# EasyEDA Pro project NI接口485_测试板子_3.eprj, board PCB2
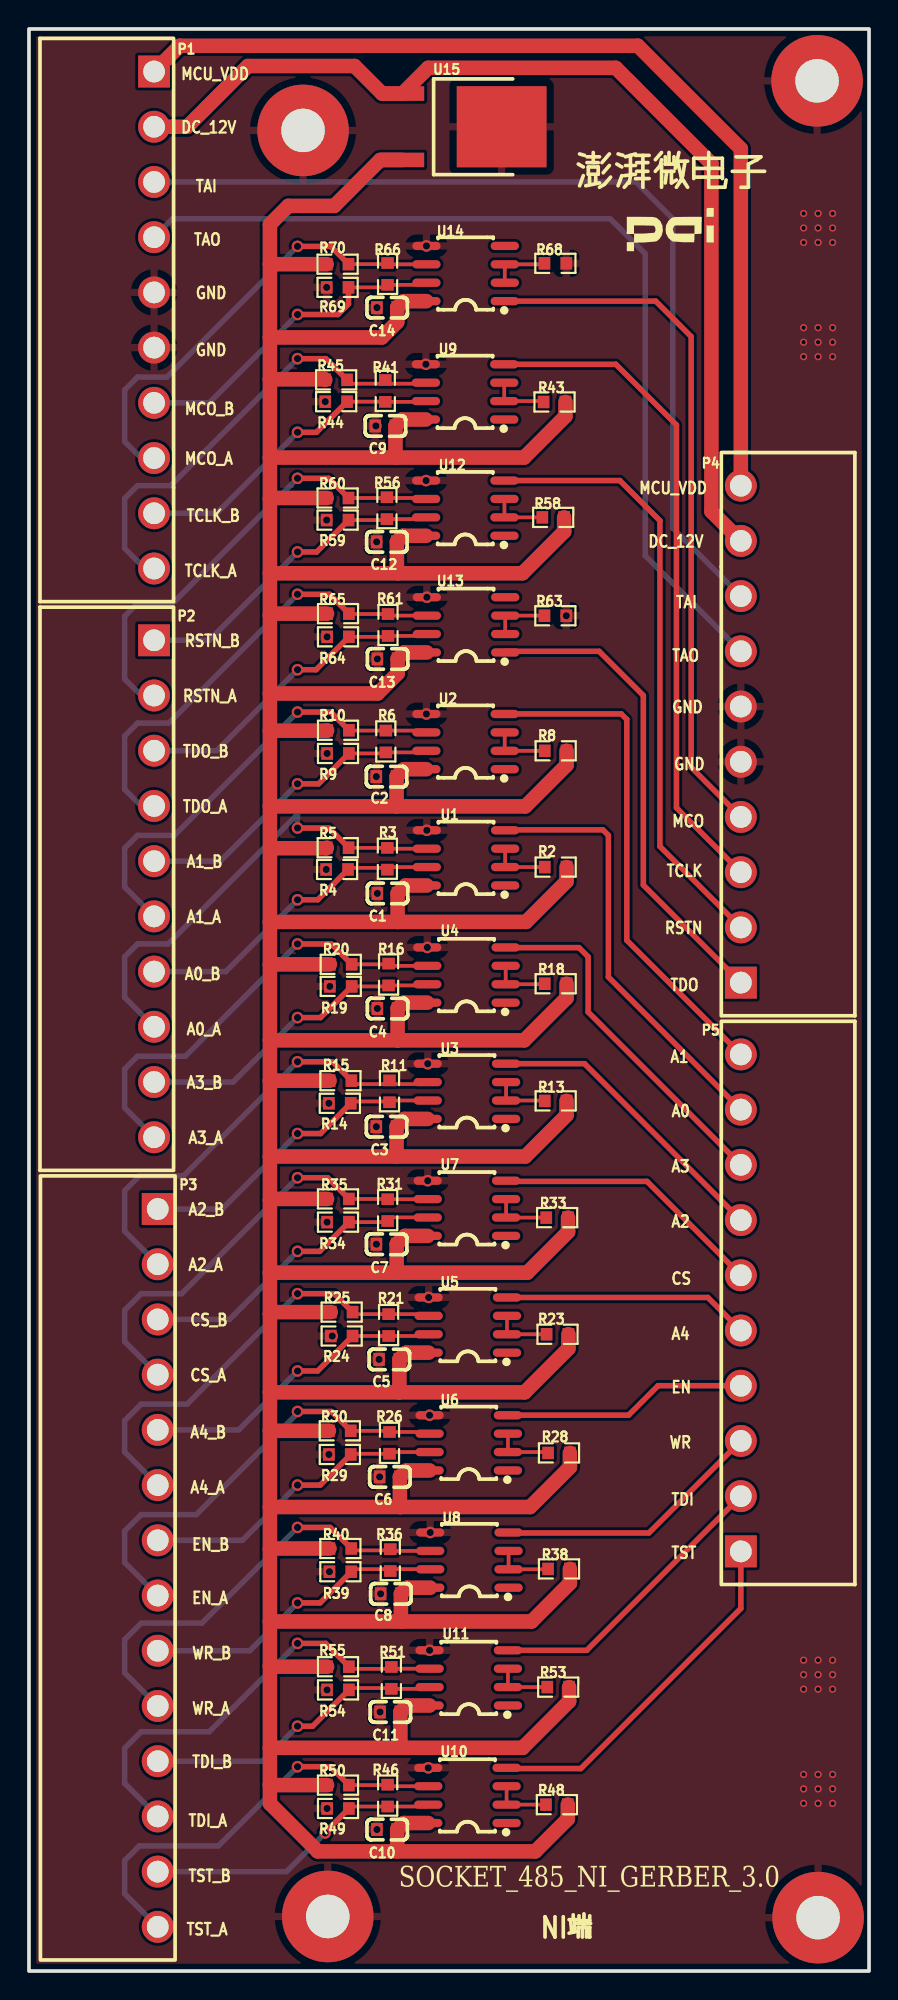
[diagram p4: board, top side]
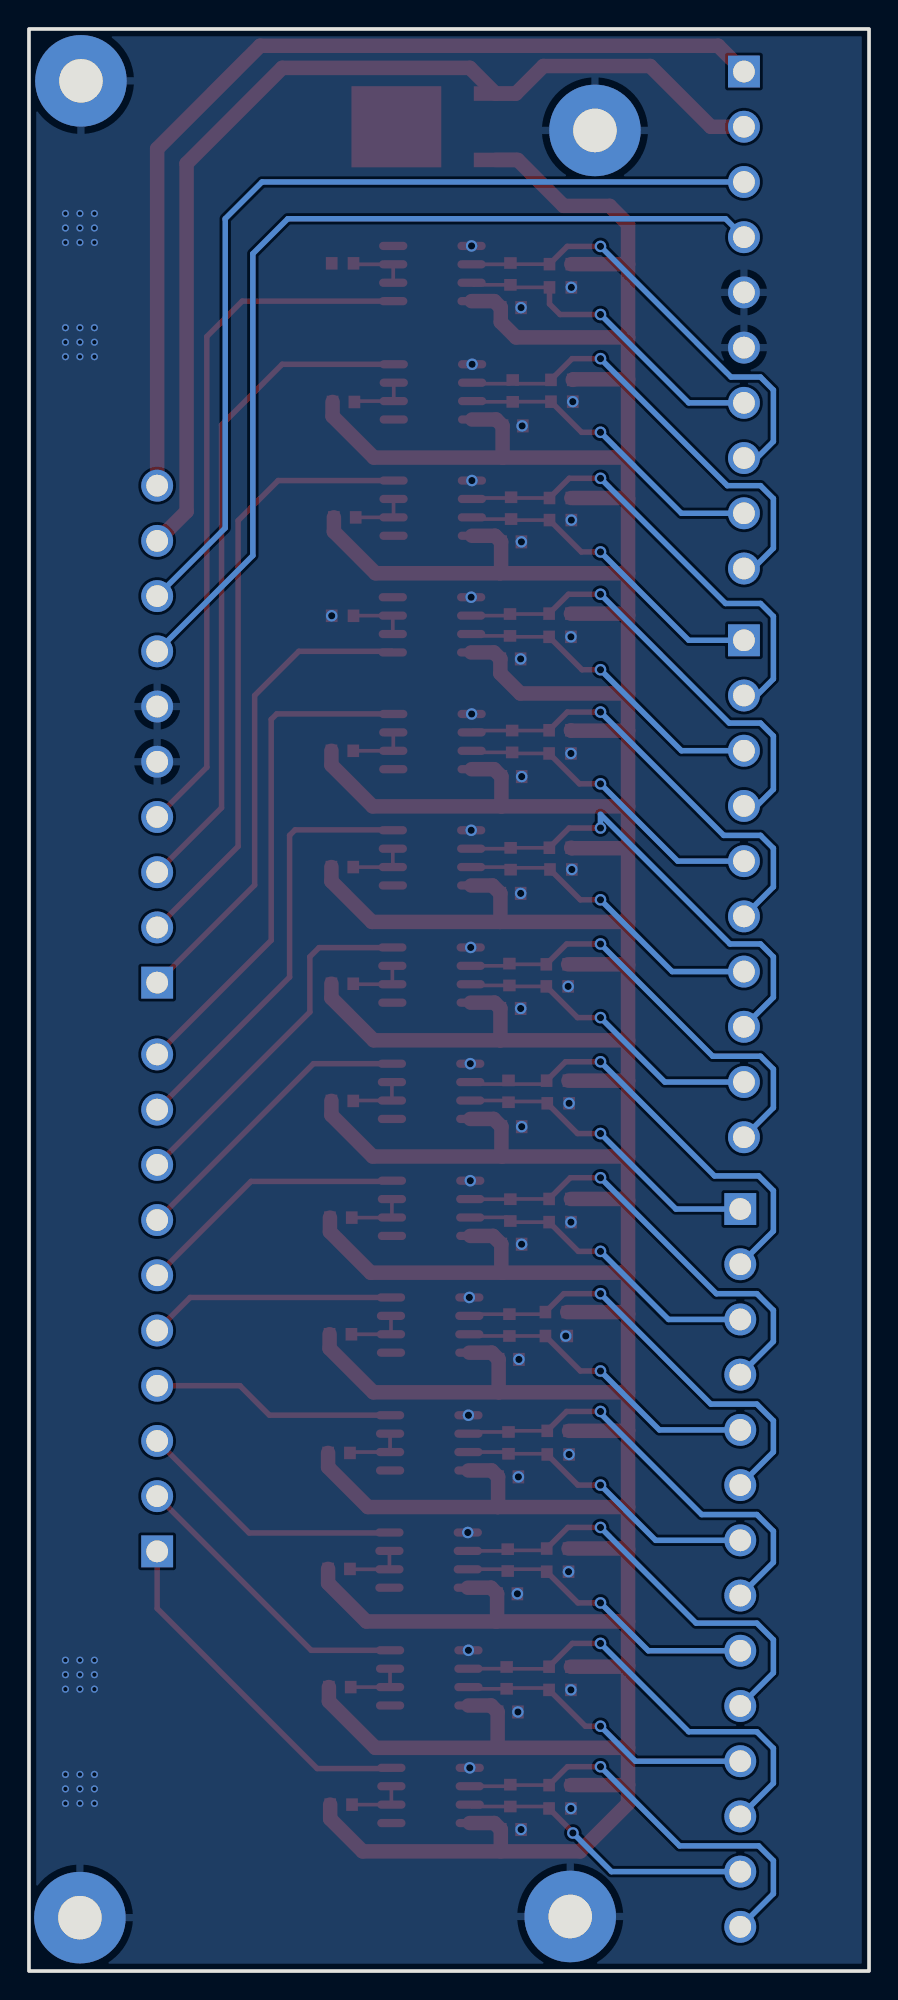
[diagram p5: board, bottom side, seen from below]

Outline 58 x 134 mm; copper layers: Top Layer, Bottom Layer. Coordinates in mm from the lower left corner of the outline.
Outline path: rectangle 0,134 58,0
Stack: Top Layer 0.035mm / Dielectric1 1.51mm FR4 er 4.5 / Bottom Layer 0.035mm

## Design rules (mm)
template: 自定义配置
spacing copperThickness1oz (default): track to track 0.102, other pairs 0.152 to 0.3
spacing copperThickness2oz: track to track 0.203, other pairs 0.152 to 0.3
track width copperThickness1oz (default): min 0.127, default 0.254, max 2.54
track width copperThickness2oz: min 0.203, default 0.254, max 2.54
differential pair differentialPair (default): width min 0.127, default 0.254, max 2.54; gap min 0.152, default 0.152
via viaSize (default): diameter min 0.5, default 0.61, max 10; hole min 0.3, default 0.305, max 6.3

## Placement (name value [footprint] x y rotation side)
C1  10uF  [C0603]  24.75 74.35 180 top
C2  10uF  [C0603]  24.68 82.42 180 top
C3  10uF  [C0603]  24.68 58.26 180 top
C4  10uF  [C0603]  24.75 66.41 180 top
C5  10uF  [C0603]  24.87 42.2 180 top
C6  10uF  [C0603]  24.91 34.1 180 top
C7  10uF  [C0603]  24.69 50.15 180 top
C8  10uF  [C0603]  24.98 26.03 180 top
C9  10uF  [C0603]  24.6 106.61 180 top
C10  10uF  [C0603]  24.72 9.76 180 top
C11  10uF  [C0603]  24.94 17.87 180 top
C12  10uF  [C0603]  24.7 98.61 180 top
C13  10uF  [C0603]  24.75 90.53 180 top
C14  10uF  [C0603]  24.72 114.77 180 top
J1  -  [demo板安装孔]  20.63 3.76 0 top
J2  -  [demo板安装孔]  18.92 127 0 top
J3  -  [demo板安装孔]  54.41 130.42 0 top
J4  -  [demo板安装孔]  54.48 3.68 0 top
P1  WJ15EDGRC-3.81-10P  [CONN-TH_10P-P3.81_WJ15EDGRC-3.81-10P]  8.64 113.92 270 top
P2  WJ15EDGRC-3.81-10P  [CONN-TH_10P-P3.81_WJ15EDGRC-3.81-10P]  8.64 74.68 270 top
P3  WJ15EDGRC-3.81-14P  [CONN-TH_14P-P3.81_WJ15EDGRC-3.81-14P]  8.89 27.81 270 top
P4  WJ15EDGRC-3.81-10P  [CONN-TH_10P-P3.81_WJ15EDGRC-3.81-10P]  49.15 85.34 90 top
P5  WJ15EDGRC-3.81-10P  [CONN-TH_10P-P3.81_WJ15EDGRC-3.81-10P]  49.15 46.1 90 top
R2  4.7kΩ  [R0603]  36.37 76.17 0 top
R3  120Ω  [R0603]  24.75 76.75 270 top
R4  4.7kΩ  [R0603]  21.27 76.01 180 top
R5  4.7kΩ  [R0603]  21.32 77.51 0 top
R6  120Ω  [R0603]  24.64 84.84 270 top
R8  4.7kΩ  [R0603]  36.37 84.19 0 top
R9  4.7kΩ  [R0603]  21.34 84.01 180 top
R10  4.7kΩ  [R0603]  21.34 85.61 0 top
R11  120Ω  [R0603]  24.89 60.7 270 top
R13  4.7kΩ  [R0603]  36.37 60.04 0 top
R14  4.7kΩ  [R0603]  21.46 59.87 180 top
R15  4.7kΩ  [R0603]  21.51 61.43 0 top
R16  120Ω  [R0603]  24.83 68.76 270 top
R18  4.7kΩ  [R0603]  36.37 68.12 0 top
R19  4.7kΩ  [R0603]  21.53 67.94 180 top
R20  4.7kΩ  [R0603]  21.53 69.46 0 top
R21  120Ω  [R0603]  24.83 44.57 270 top
R23  4.7kΩ  [R0603]  36.49 43.94 0 top
R24  4.7kΩ  [R0603]  21.59 43.81 180 top
R25  4.7kΩ  [R0603]  21.59 45.47 0 top
R26  120Ω  [R0603]  24.89 36.44 270 top
R28  4.7kΩ  [R0603]  36.59 35.75 0 top
R29  4.7kΩ  [R0603]  21.46 35.64 180 top
R30  4.7kΩ  [R0603]  21.46 37.27 0 top
R31  120Ω  [R0603]  24.77 52.5 270 top
R33  4.7kΩ  [R0603]  36.47 51.98 0 top
R34  4.7kΩ  [R0603]  21.34 51.67 180 top
R35  4.7kΩ  [R0603]  21.34 53.27 0 top
R36  120Ω  [R0603]  24.95 28.35 270 top
R38  4.7kΩ  [R0603]  36.59 27.75 0 top
R39  4.7kΩ  [R0603]  21.5 27.55 180 top
R40  4.7kΩ  [R0603]  21.5 29.15 0 top
R41  120Ω  [R0603]  24.6 109.03 270 top
R43  4.7kΩ  [R0603]  36.29 108.26 0 top
R44  4.7kΩ  [R0603]  21.21 108.29 180 top
R45  4.7kΩ  [R0603]  21.21 109.79 0 top
R46  120Ω  [R0603]  24.77 12.1 270 top
R48  4.7kΩ  [R0603]  36.45 11.48 0 top
R49  4.7kΩ  [R0603]  21.34 11.22 180 top
R50  4.7kΩ  [R0603]  21.34 12.83 0 top
R51  120Ω  [R0603]  25.02 20.22 270 top
R53  4.7kΩ  [R0603]  36.54 19.59 0 top
R54  4.7kΩ  [R0603]  21.34 19.4 180 top
R55  4.7kΩ  [R0603]  21.34 21 0 top
R56  120Ω  [R0603]  24.71 100.94 270 top
R58  4.7kΩ  [R0603]  36.19 100.3 0 top
R59  4.7kΩ  [R0603]  21.31 100.11 180 top
R60  4.7kΩ  [R0603]  21.31 101.64 0 top
R61  120Ω  [R0603]  24.79 92.88 270 top
R63  4.7kΩ  [R0603]  36.34 93.51 0 top
R64  4.7kΩ  [R0603]  21.34 92.06 180 top
R65  4.7kΩ  [R0603]  21.34 93.66 0 top
R66  120Ω  [R0603]  24.76 117.1 270 top
R68  4.7kΩ  [R0603]  36.34 117.83 0 top
R69  4.7kΩ  [R0603]  21.31 116.17 180 top
R70  4.7kΩ  [R0603]  21.31 117.77 0 top
U1  SP485EEN-L/TR  [SOIC-8_L5.0-W4.0-P1.27-LS6.0-BL]  30.17 76.81 90 top
U2  SP485EEN-L/TR  [SOIC-8_L5.0-W4.0-P1.27-LS6.0-BL]  30.14 84.83 90 top
U3  SP485EEN-L/TR  [SOIC-8_L5.0-W4.0-P1.27-LS6.0-BL]  30.24 60.7 90 top
U4  SP485EEN-L/TR  [SOIC-8_L5.0-W4.0-P1.27-LS6.0-BL]  30.21 68.72 90 top
U5  SP485EEN-L/TR  [SOIC-8_L5.0-W4.0-P1.27-LS6.0-BL]  30.3 44.57 90 top
U6  SP485EEN-L/TR  [SOIC-8_L5.0-W4.0-P1.27-LS6.0-BL]  30.36 36.44 90 top
U7  SP485EEN-L/TR  [SOIC-8_L5.0-W4.0-P1.27-LS6.0-BL]  30.24 52.63 90 top
U8  SP485EEN-L/TR  [SOIC-8_L5.0-W4.0-P1.27-LS6.0-BL]  30.41 28.35 90 top
U9  SP485EEN-L/TR  [SOIC-8_L5.0-W4.0-P1.27-LS6.0-BL]  30.11 108.96 90 top
U10  SP485EEN-L/TR  [SOIC-8_L5.0-W4.0-P1.27-LS6.0-BL]  30.27 12.11 90 top
U11  SP485EEN-L/TR  [SOIC-8_L5.0-W4.0-P1.27-LS6.0-BL]  30.36 20.22 90 top
U12  SP485EEN-L/TR  [SOIC-8_L5.0-W4.0-P1.27-LS6.0-BL]  30.12 100.94 90 top
U13  SP485EEN-L/TR  [SOIC-8_L5.0-W4.0-P1.27-LS6.0-BL]  30.18 92.89 90 top
U14  SP485EEN-L/TR  [SOIC-8_L5.0-W4.0-P1.27-LS6.0-BL]  30.15 117.13 90 top
U15  78M05  [TO-252-2_L6.5-W5.5-P4.58-LS9.8-BR-CW]  29.21 127.25 180 top

## Footprints (pads in the part's own frame, mm; a bottom-side part is the same pattern mirrored in y, then rotated)
C0603
  rect 0.8x0.9 smd: 1(-0.7,0) 2(0.7,0)
CONN-TH_10P-P3.81_WJ15EDGRC-3.81-10P
  rect 2.2x2.2 hole 1.5: 1(-17.145,0)
  round 2.2 hole 1.5: 2(-13.335,0) 3(-9.525,0) 4(-5.715,0) 5(-1.905,0) 6(1.905,0) 7(5.715,0) 8(9.525,0) 9(13.335,0) 10(17.145,0)
CONN-TH_14P-P3.81_WJ15EDGRC-3.81-14P
  rect 2.2x2.2 hole 1.5: 1(-24.765,0)
  round 2.2 hole 1.5: 2(-20.955,0) 3(-17.145,0) 4(-13.335,0) 5(-9.525,0) 6(-5.715,0) 7(-1.905,0) 8(1.905,0) 9(5.715,0) 10(9.525,0) 11(13.335,0) 12(17.145,0) 13(20.955,0) 14(24.765,0)
demo板安装孔
  round 6.32 hole 3: 1(0,0)
R0603
  rect 0.806x0.864 smd: 1(-0.753,0) 2(0.753,0)
SOIC-8_L5.0-W4.0-P1.27-LS6.0-BL
  oval 0.569x1.95 smd: 1(-1.905,-2.705) 2(-0.635,-2.705) 3(0.635,-2.705) 4(1.905,-2.705) 5(1.905,2.705) 6(0.635,2.705) 7(-0.635,2.705) 8(-1.905,2.705)
TO-252-2_L6.5-W5.5-P4.58-LS9.8-BR-CW
  rect 3x1 smd: 1(3.423,-2.29) 3(3.424,2.29)
  rect 6.2x5.6 smd: 2(-3.424,0)

## Nets
As in the schematic.

Pads without a net: U1 1; U2 1; U3 1; U4 1; U5 1; U6 1; U7 1; U8 1; U9 1; U10 1; U11 1; U12 1; U13 4; U14 4

## Via types
v1: diameter 0.8, hole 0.5, Top Layer to Bottom Layer, 71 vias
v2: diameter 0.5, hole 0.305, Top Layer to Bottom Layer, 36 vias

## Routing (per net, layer and track width the routed paths; a pad name or vN(x,y) marks a point on that pad's centre or on a via; arc(x,y) is an arc through that point)
GND:
  vias: v1(20.46,108.29) v1(20.55,116.17) v1(20.55,100.11) v1(20.52,76.01) v1(20.58,92.06) v1(20.58,84.01) v1(20.58,51.67) v1(20.58,19.4) v1(20.58,11.22) v1(20.71,59.87) v1(20.71,35.64) v1(20.75,27.55) v1(20.77,67.94) v1(20.94,43.81) v1(23.95,106.61) v1(24.03,114.77) v1(24,98.61) v1(24.05,90.53) v1(23.98,82.42) v1(24.05,74.35) v1(24.05,66.41) v1(23.98,58.26) v1(23.99,50.15) v1(24.02,9.76) v1(24.17,42.2) v1(24.21,34.1) v1(24.24,17.87) v1(24.28,26.03) v1(27.44,119.03) v1(27.4,110.86) v1(27.42,102.84) v1(27.44,86.73) v1(27.47,94.79) v1(27.47,78.71) v1(27.5,70.63) v1(27.53,62.6) v1(27.53,54.53) v1(27.59,46.48) v1(27.66,38.35) v1(27.66,22.13) v1(27.57,14.02) v1(27.7,30.26) v1(37.1,93.51) v2(53.48,121.27) v2(53.48,120.27) v2(53.48,119.27) v2(53.48,113.39) v2(53.48,112.39) v2(53.48,111.39) v2(53.48,21.45) v2(53.48,20.45) v2(53.48,19.45) v2(53.48,13.57) v2(53.48,12.57) v2(53.48,11.57) v2(54.48,121.27) v2(54.48,120.27) v2(54.48,119.27) v2(54.48,113.39) v2(54.48,112.39) v2(54.48,111.39) v2(54.48,21.45) v2(54.48,20.45) v2(54.48,19.45) v2(54.48,13.57) v2(54.48,12.57) v2(54.48,11.57) v2(55.48,121.27) v2(55.48,120.27) v2(55.48,119.27) v2(55.48,113.39) v2(55.48,112.39) v2(55.48,111.39) v2(55.48,21.45) v2(55.48,20.45) v2(55.48,19.45) v2(55.48,13.57) v2(55.48,12.57) v2(55.48,11.57)
DC_12V: length 71.4
  Top Layer w1: P1.2 10.92,127.25 15.11,131.44 22.48,131.44 24.38,129.54 U15.1 27.56,131.32 40.51,131.32 47.12,124.71 47.12,100.71 P4.9
LDO_5V: length 527
  Top Layer w0.254: 20.57,117.73 20.55,117.75 R70.1
  Top Layer w1: U2.8 25.89,82.92 C2.1 25.38,80.37 25.38,80.36 ; 25.31,48.19 16.64,48.19 ; 25.31,48.19 25.39,48.27 C7.1 25.96,50.72 U7.8 ; 25.31,48.19 34.41,48.19 37.22,51 R33.2 ; 16.64,48.19 16.64,53.18 ; 16.64,48.19 16.64,45.34 ; 25.55,39.93 25.57,39.95 C5.1 26.04,42.67 U5.8 ; 25.55,39.93 16.64,39.93 ; 25.55,39.93 34.22,39.93 37.25,42.95 R23.2 ; 16.64,45.34 16.77,45.47 R25.1 ; 16.64,45.34 16.64,39.93 ; 16.64,24.12 16.64,21.06 ; 16.64,24.12 16.64,29.1 ; 16.64,24.12 25.74,24.12 ; 16.64,21.06 16.64,15.4 ; 16.64,21.06 16.71,21 R55.1 ; 25.3,104.43 25.3,104.43 C9.1 25.74,107.05 U9.8 ; 25.3,104.43 16.64,104.43 ; 25.3,104.43 34.19,104.43 37.04,107.28 R43.2 ; U6.8 26.05,34.54 C6.1 25.61,32.04 25.64,32.02 ; 16.64,61.42 16.65,61.43 R15.1 ; 16.64,61.42 16.64,56.2 ; 16.64,61.42 16.64,64.22 ; U8.8 26.1,26.45 C8.1 25.68,24.18 25.74,24.12 ; 16.64,39.93 16.64,37.3 ; 16.64,80.36 25.38,80.36 ; 16.64,80.36 16.64,85.58 ; 16.64,80.36 16.64,77.47 ; 25.38,80.36 34.27,80.36 37.12,83.21 R8.2 ; U14.8 25.87,115.22 C14.1 25.43,113.77 24.37,112.72 16.64,112.72 ; 16.64,15.4 25.64,15.4 ; 16.64,15.4 16.64,12.84 ; 25.64,15.4 C11.1 26.09,18.32 U11.8 ; 25.64,15.4 34.09,15.4 37.29,18.61 R53.2 ; 16.64,112.72 16.64,109.83 ; 16.64,112.72 16.64,117.77 ; 16.64,109.83 20.42,109.83 R45.1 ; 16.64,109.83 16.64,104.43 ; 16.64,29.1 16.64,32.02 ; 16.64,29.1 16.69,29.15 R40.1 ; 16.64,56.2 25.33,56.2 ; 16.64,56.2 16.64,53.18 ; 25.33,56.2 25.38,56.25 C3.1 25.92,58.79 U3.8 ; 25.33,56.2 34.27,56.2 37.12,59.05 R13.2 ; 16.64,77.47 20.53,77.47 R5.1 ; 16.64,77.47 16.64,72.39 ; 16.64,37.3 16.67,37.27 R30.1 ; 16.64,37.3 16.64,32.02 ; R35.1 16.73,53.27 16.64,53.18 ; R18.2 37.12,67.14 34.2,64.22 25.46,64.22 ; 16.64,12.84 16.64,11.56 19.94,8.25 34.96,8.25 37.2,10.5 R48.2 ; 16.64,12.84 16.65,12.83 R50.1 ; 25.46,64.22 16.64,64.22 ; 25.46,64.22 25.45,64.22 C4.1 25.85,66.82 U4.8 ; R2.2 37.12,75.19 34.32,72.39 25.49,72.39 ; U1.8 26,74.9 C1.1 25.45,72.42 25.49,72.39 ; U13.8 25.9,90.98 C13.1 25.45,89.53 24.07,88.15 16.64,88.15 ; 16.64,72.39 25.49,72.39 ; 16.64,72.39 16.64,69.42 ; 16.64,32.02 25.64,32.02 ; 16.64,93.55 16.64,88.15 ; 16.64,93.55 16.74,93.66 R65.1 ; 16.64,93.55 16.64,96.45 ; 16.64,88.15 16.64,85.58 ; 16.64,104.43 16.64,101.59 ; R20.1 16.68,69.46 16.64,69.42 ; R60.1 16.69,101.64 16.64,101.59 ; 16.64,85.58 20.55,85.58 R10.1 ; 16.64,69.42 16.64,64.22 ; 16.64,101.59 16.64,96.45 ; 16.64,96.45 25.47,96.45 ; 25.64,32.02 34.6,32.02 37.35,34.76 R28.2 ; 16.64,117.77 16.64,120.52 17.91,121.79 21.08,121.79 24.25,124.96 U15.3 ; 16.64,117.77 R70.1 ; R58.2 36.95,99.32 34.07,96.45 25.47,96.45 ; 25.74,24.12 34.7,24.12 37.35,26.76 R38.2 ; 25.47,96.45 25.4,96.52 C12.1 25.82,99.03 U12.8 ; 25.42,8.26 C10.1 25.87,10.21 U10.8
MCO_NI: length 48.4
  Top Layer w0.38: U14.1 43.28,115.22 45.72,112.78 45.72,83.06 P4.4
MCO_NI_A: length 31.6
  Top Layer w0.254: R70.2 24.68,117.77 R66.1 24.85,117.76 U14.6
  Top Layer w0.38: v1(18.54,119) 20.83,119 R70.2
  Bottom Layer w0.38: P1.8 7.75,104.39 6.6,105.54 6.6,109.09 7.49,109.98 9.53,109.98 v1(18.54,119)
MCO_NI_B: length 22.9
  Top Layer w0.254: R69.1 24.59,116.17 R66.2 27.3,116.35 U14.7
  Top Layer w0.38: R69.1 22.06,115.02 21.34,114.3 v1(18.54,114.3)
  Bottom Layer w0.38: P1.7 12.45,108.2 v1(18.54,114.3)
MCU_VDD: length 67.4
  Top Layer w1: P4.10 49.15,125.73 42.04,132.84 10.41,132.84 P1.1
RSTN_NI: length 42.3
  Top Layer w0.38: P4.2 43.56,77.6 43.56,100.08 40.8,102.84 U12.4
RSTN_NI_A: length 32.2
  Top Layer w0.254: 24.66,101.64 R60.2 ; 24.66,101.64 R56.1 ; 24.66,101.64 27.35,101.64 U12.6
  Top Layer w0.38: v1(18.54,103) 20.7,103 R60.2
  Bottom Layer w0.38: v1(18.54,103) 9.91,94.36 7.49,94.36 6.6,93.47 6.6,89.15 7.75,88.01 P2.2
RSTN_NI_B: length 22.3
  Top Layer w0.254: U12.7 27.3,100.18 R56.2 24.64,100.11 R59.1
  Top Layer w0.38: R59.1 19.86,97.92 v1(18.54,97.92)
  Bottom Layer w0.38: v1(18.54,97.92) 12.45,91.82 P2.1
SW_A0: length 30
  Top Layer w0.38: U1.4 32.91,78.74 39.62,78.74 40,78.36 40,68.58 P5.9
SW_A0_A: length 32.1
  Top Layer w0.254: 22.08,77.5 R3.1 24.8,77.44 U1.6
  Top Layer w0.38: R5.2 20.71,78.87 v1(18.54,78.87)
  Bottom Layer w0.38: 8.64,65.15 6.6,67.18 6.6,69.98 7.49,70.87 9.6,70.87 18.54,79.81 v1(18.54,78.87)
SW_A0_B: length 21.9
  Top Layer w0.254: U1.7 24.92,76.17 R3.2 24.62,76.12 22.14,76.12 22.03,76.01
  Top Layer w0.38: 22.03,76.01 19.94,73.91 v1(18.54,73.91)
  Bottom Layer w0.38: P2.7 13.59,68.96 v1(18.54,73.91)
SW_A1: length 35
  Top Layer w0.38: U2.4 32.85,86.74 40.9,86.74 41.28,86.36 41.28,71.12 P5.10
SW_A1_A: length 30.8
  Top Layer w0.254: U2.6 27.31,85.59 R6.1 22.11,85.59
  Top Layer w0.38: R10.2 20.83,86.87 v1(18.54,86.87)
  Bottom Layer w0.38: v1(18.54,86.87) 10.03,78.36 7.49,78.36 6.6,77.47 6.6,74.8 P2.6
SW_A1_B: length 22
  Top Layer w0.254: U2.7 27.33,84.09 R6.2 24.56,84.01 R9.1
  Top Layer w0.38: v1(18.54,81.91) 19.99,81.91 R9.1
  Bottom Layer w0.38: P2.5 13.21,76.58 v1(18.54,81.91)
SW_A2: length 20.7
  Top Layer w0.38: P5.7 38.36,62.6 U3.4
SW_A2_A: length 31.5
  Top Layer w0.254: R15.2 22.5,61.2 24.64,61.2 R11.1 25.15,61.2 27.4,61.2 U3.6
  Top Layer w0.38: R15.2 20.96,62.74 v1(18.54,62.74)
  Bottom Layer w0.38: v1(18.54,62.74) 10.67,54.86 7.62,54.86 6.6,53.85 6.6,51.05 P3.2
SW_A2_B: length 21.8
  Top Layer w0.254: R14.1 22.34,60 24.84,60 R11.2 25.01,60.06 U3.7
  Top Layer w0.38: R14.1 20.13,57.78 v1(18.54,57.78)
  Bottom Layer w0.38: v1(18.54,57.78) 13.34,52.58 P3.1
SW_A3: length 24.7
  Top Layer w0.38: P5.8 38.61,66.17 38.61,69.98 37.97,70.61 32.93,70.61 U4.4
SW_A3_A: length 30.7
  Top Layer w0.254: U4.6 24.98,69.36 24.83,69.51 24.78,69.46 R20.2
  Top Layer w0.38: R20.2 20.88,70.87 v1(18.54,70.87)
  Bottom Layer w0.38: v1(18.54,70.87) 10.8,63.12 7.49,63.12 6.6,62.23 6.6,59.56 P2.10
SW_A3_B: length 21.7
  Top Layer w0.254: R19.1 24.76,67.94 R16.2 27.42,68 U4.7
  Top Layer w0.38: R19.1 20.13,65.79 v1(18.54,65.79)
  Bottom Layer w0.38: P2.9 14.1,61.34 v1(18.54,65.79)
SW_A4: length 17.1
  Top Layer w0.38: P5.5 46.87,46.48 33,46.48
SW_A4_A: length 30.6
  Top Layer w0.254: R25.2 22.49,45.32 R21.1 27.48,45.32 U5.6
  Top Layer w0.38: v1(18.54,46.74) 21.07,46.74 R25.2
  Bottom Layer w0.38: v1(18.54,46.74) 10.92,39.12 7.75,39.12 6.6,37.97 6.6,35.81 P3.6
SW_A4_B: length 21.4
  Top Layer w0.254: 22.35,43.82 R21.2 27.48,43.82 U5.7
  Top Layer w0.38: R24.1 19.93,41.4 v1(18.54,41.4)
  Bottom Layer w0.38: v1(18.54,41.4) 14.48,37.34 P3.5
SW_CS_N: length 18.9
  Top Layer w0.38: U7.4 32.99,54.48 42.67,54.48 P5.6
SW_CS_N_A: length 30.7
  Top Layer w0.254: R35.2 24.75,53.27 R31.1 27.52,53.25 U7.6
  Top Layer w0.38: v1(18.54,54.74) 20.62,54.74 R35.2
  Bottom Layer w0.38: v1(18.54,54.74) 10.54,46.74 7.75,46.74 6.6,45.59 6.6,43.43 P3.4
SW_CS_N_B: length 21.6
  Top Layer w0.254: U7.7 27.52,52 25.02,52 R31.2 24.69,51.67 R34.1
  Top Layer w0.38: v1(18.54,49.66) 20.07,49.66 R34.1
  Bottom Layer w0.38: P3.3 13.84,44.96 v1(18.54,49.66)
SW_EN_N: length 16.9
  Top Layer w0.38: U6.4 33.07,38.35 41.4,38.35 43.43,40.39 P5.4
SW_EN_N_A: length 30.6
  Top Layer w0.254: R30.2 24.81,37.27 R26.1 27.54,37.2 U6.6
  Top Layer w0.38: R30.2 20.88,38.61 v1(18.54,38.61)
  Bottom Layer w0.38: v1(18.54,38.61) 18.54,38.48 11.56,31.5 7.75,31.5 6.6,30.35 6.6,28.19 P3.8
SW_EN_N_B: length 21.3
  Top Layer w0.254: R29.1 22.26,35.69 R26.2 25.01,35.81 U6.7
  Top Layer w0.38: R29.1 20.1,33.53 v1(18.54,33.53)
  Bottom Layer w0.38: v1(18.54,33.53) 14.73,29.72 P3.7
SW_WR_N: length 18.7
  Top Layer w0.38: U8.4 33.15,30.23 42.8,30.23 P5.3
SW_WR_N_A: length 30.6
  Top Layer w0.254: R40.2 22.38,29.03 24.87,29.03 R36.1 25.06,28.99 U8.6
  Top Layer w0.38: v1(18.54,30.61) 20.8,30.61 R40.2
  Bottom Layer w0.38: P3.10 6.6,20.57 6.6,22.86 7.75,24 11.94,24 v1(18.54,30.61)
SW_WR_N_B: length 21.3
  Top Layer w0.254: U8.7 27.69,27.73 25.07,27.73 R36.2 24.82,27.73 22.43,27.73 R39.1
  Top Layer w0.38: v1(18.54,25.4) 20.1,25.4 R39.1
  Bottom Layer w0.38: v1(18.54,25.4) 15.24,22.1 P3.9
TAI_NI: length 64.8
  Bottom Layer w0.38: P4.8 44.45,99.57 44.45,120.9 41.91,123.44 P1.3
TAO_NI: length 65.6
  Bottom Layer w0.38: P4.7 42.55,97.66 42.55,118.49 40.13,120.9 9.91,120.9 P1.4
TCLK_NI: length 46.3
  Top Layer w0.38: U9.4 40.52,110.86 44.7,106.68 44.7,80.26 P4.3
TCLK_NI_A: length 31.8
  Top Layer w0.254: R45.2 22.23,109.52 24.35,109.52 R41.1 24.86,109.52 27.33,109.52 U9.6
  Top Layer w0.38: R45.2 20.5,111.25 v1(18.54,111.25)
  Bottom Layer w0.38: v1(18.54,111.25) 9.78,102.49 7.49,102.49 6.6,101.6 6.6,98.17 8,96.77 P1.10
TCLK_NI_B: length 22
  Top Layer w0.254: R44.1 24.59,108.29 R41.2 27.35,108.27 U9.7
  Top Layer w0.38: v1(18.54,106.17) 19.85,106.17 R44.1
  Bottom Layer w0.38: v1(18.54,106.17) 12.95,100.58 P1.9
TDI_NI: length 20.5
  Top Layer w0.38: U11.4 38.51,22.13 P5.2
TDI_NI_A: length 30.5
  Top Layer w0.254: R55.2 22.24,20.85 24.89,20.85 R51.1 25.14,20.86 U11.6
  Top Layer w0.38: R55.2 20.48,22.61 v1(18.54,22.61)
  Bottom Layer w0.38: v1(18.54,22.61) 12.45,16.51 7.75,16.51 6.6,15.37 6.6,12.95 P3.12
TDI_NI_B: length 20.9
  Top Layer w0.254: U11.7 27.54,19.47 R51.2 24.97,19.52 22.22,19.52 R54.1
  Top Layer w0.38: v1(18.54,16.89) 19.58,16.89 R54.1
  Bottom Layer w0.38: P3.11 16.13,14.48 v1(18.54,16.89)
TDO_NI: length 33.4
  Top Layer w0.38: U13.1 32.96,91.06 39.37,91.06 42.42,88.01 42.42,74.93 P4.1
TDO_NI_A: length 31.7
  Top Layer w0.254: U13.6 24.9,93.52 R61.1 22.12,93.63
  Top Layer w0.38: v1(18.54,95) 20.75,95 R65.2
  Bottom Layer w0.38: P2.4 7.75,80.39 6.6,81.53 6.6,85.22 7.49,86.11 9.65,86.11 v1(18.54,95)
TDO_NI_B: length 22.2
  Top Layer w0.254: U13.7 27.34,92.12 R61.2 24.72,92.06 R64.1
  Top Layer w0.38: R64.1 19.82,89.79 v1(18.54,89.79)
  Bottom Layer w0.38: v1(18.54,89.79) 12.95,84.2 P2.3
TSTROBE_NI: length 24.7
  Top Layer w0.38: U10.4 33.03,13.97 38.1,13.97 49.15,25.02 P5.1
TSTROBE_NI_A: length 29.7
  Top Layer w0.254: R50.2 24.73,12.83 R46.1 24.87,12.75 U10.6
  Top Layer w0.38: v1(18.54,14.1) 20.82,14.1 R50.2
  Bottom Layer w0.38: v1(18.54,14.1) 13.08,8.64 7.62,8.64 6.6,7.62 6.6,5.33 P3.14
TSTROBE_NI_B: length 20.6
  Top Layer w0.254: R49.1 22.23,11.35 R46.2 27.44,11.35 U10.7
  Top Layer w0.38: R49.1 20.45,9.57 v1(20.45,9.53)
  Bottom Layer w0.38: v1(20.45,9.53) 17.78,6.86 P3.13
$1N33003: length 4
  Top Layer w0.254: R2.1 U1.2 U1.3
$1N33046: length 4
  Top Layer w0.254: R8.1 U2.2 U2.3
$1N33127: length 4
  Top Layer w0.254: U3.3 U3.2 35.59,60.06 R13.1
$1N33159: length 4
  Top Layer w0.254: U4.3 U4.2 35.58,68.09 R18.1
$1N33197: length 4
  Top Layer w0.254: R23.1 33,43.94 33,45.21
$1N33551: length 4.1
  Top Layer w0.254: U6.3 U6.2 35.78,35.81 R28.1
$1N33913: length 4
  Top Layer w0.254: R33.1 32.95,51.98 U7.2 U7.3
$1N34275: length 4
  Top Layer w0.254: R38.1 35.81,27.72 U8.2 U8.3
$1N34989: length 4
  Top Layer w0.254: U9.3 U9.2 35.47,108.32 R43.1
$1N35351: length 4
  Top Layer w0.254: R48.1 U10.2 U10.3
$1N35713: length 4
  Top Layer w0.254: U11.3 U11.2 R53.1
$1N36075: length 3.9
  Top Layer w0.254: U12.3 U12.2 R58.1
$1N36432: length 4
  Top Layer w0.254: U13.2 U13.3 35.58,93.52 R63.1
$1N36797: length 4
  Top Layer w0.254: R68.1 35.52,117.76 U14.3 U14.2

## Copper pours and planes (outline as drawn; the poured copper is in the pictures)
GND on Top Layer: 0,134 58,134 58,0 0,0
GND on Bottom Layer: 0,134 58,134 58,0 0,0

## Text on the board
Top Silkscreen Layer: MCU_VDD | DC_12V | RSTN_A | TDO_B | TDO_A | MCO_B | MCO_A | TCLK_A | RSTN_B | A0_B | TCLK_B | A1_B | A1_A | A0_A | A3_B | TST_A | A3_A | A2_B | A2_A | TDI_A | TST_B | CS_B | CS_A | A4_B | A4_A | EN_B | EN_A | WR_B | WR_A | TDI_B | TAO | TAI | GND | RSTN | TCLK | WR | TDO | A1 | A3 | A2 | CS | A4 | EN | TDI | TST | A0 | MCO | 澎湃微电子 | SOCKET_485_NI_GERBER_3.0 | NI端
